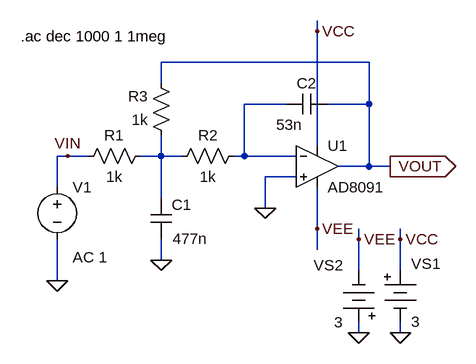
[diagram p0: schematic fig-02-07-32.asc]
fig-02-07-32.asc, the LTspice schematic file:
Version 4
SHEET 1 880 680
WIRE 192 -48 192 -64
WIRE 272 0 -48 0
WIRE -48 32 -48 0
WIRE 144 64 80 64
WIRE 272 64 272 0
WIRE 272 64 208 64
WIRE 192 128 192 -48
WIRE -192 144 -208 144
WIRE -160 144 -192 144
WIRE -48 144 -48 112
WIRE -48 144 -80 144
WIRE -16 144 -48 144
WIRE 80 144 80 64
WIRE 80 144 64 144
WIRE 160 144 80 144
WIRE 272 160 272 64
WIRE 272 160 224 160
WIRE 304 160 272 160
WIRE 160 176 112 176
WIRE -208 192 -208 144
WIRE -48 208 -48 144
WIRE 112 224 112 176
WIRE 192 256 192 192
WIRE 256 272 256 256
WIRE 320 272 320 256
WIRE 192 288 192 256
WIRE -48 304 -48 272
WIRE 256 320 256 272
WIRE 320 320 320 272
WIRE -208 336 -208 272
WIRE 256 416 256 400
WIRE 320 416 320 400
FLAG -48 304 0
FLAG -208 336 0
FLAG 304 160 VOUT
IOPIN 304 160 Out
FLAG -192 144 VIN
FLAG 112 224 0
FLAG 256 416 0
FLAG 320 416 0
FLAG 256 272 VEE
FLAG 320 272 VCC
FLAG 192 -48 VCC
FLAG 192 256 VEE
SYMBOL Opamps\\AD8091 192 96 R0
SYMATTR InstName U1
SYMBOL cap -64 208 R0
WINDOW 0 32 11 Left 2
WINDOW 3 34 63 Left 2
SYMATTR InstName C1
SYMATTR Value 477n
SYMBOL cap 208 48 R90
WINDOW 0 0 32 VBottom 2
WINDOW 3 32 59 VTop 2
SYMATTR InstName C2
SYMATTR Value 53n
SYMBOL res 80 128 R90
WINDOW 0 0 56 VBottom 2
WINDOW 3 32 56 VTop 2
SYMATTR InstName R2
SYMATTR Value 1k
SYMBOL res -64 128 R90
WINDOW 0 0 56 VBottom 2
WINDOW 3 32 56 VTop 2
SYMATTR InstName R1
SYMATTR Value 1k
SYMBOL voltage -208 176 R0
WINDOW 123 24 124 Left 2
WINDOW 39 0 0 Left 2
SYMATTR Value2 AC 1
SYMATTR InstName V1
SYMATTR Value ""
SYMBOL res -32 128 R180
WINDOW 0 36 76 Left 2
WINDOW 3 36 40 Left 2
SYMATTR InstName R3
SYMATTR Value 1k
SYMBOL Misc\\battery 320 304 R0
WINDOW 0 17 6 Left 2
WINDOW 3 17 95 Left 2
SYMATTR InstName VS1
SYMATTR Value 3
SYMBOL Misc\\battery 256 416 R180
WINDOW 0 24 104 Left 2
WINDOW 3 24 16 Left 2
SYMATTR InstName VS2
SYMATTR Value 3
TEXT -264 -40 Left 2 !.ac dec 1000 1 1meg

The netlist it stands for:
* fig-02-07-32.asc
XU1 0 N001 VCC VEE VOUT AD8091  ; pins In+ In- V+ V- OUT
C1 N002 0 477n
C2 VOUT N001 53n
R2 N001 N002 1k
R1 N002 VIN 1k
V1 VIN 0 AC 1
R3 N002 VOUT 1k
VS1 VCC 0 3
VS2 0 VEE 3
.ac dec 1000 1 1meg
.backanno
.end